# EAGLE design DorkBoard-Programming (EAGLE 5.00)
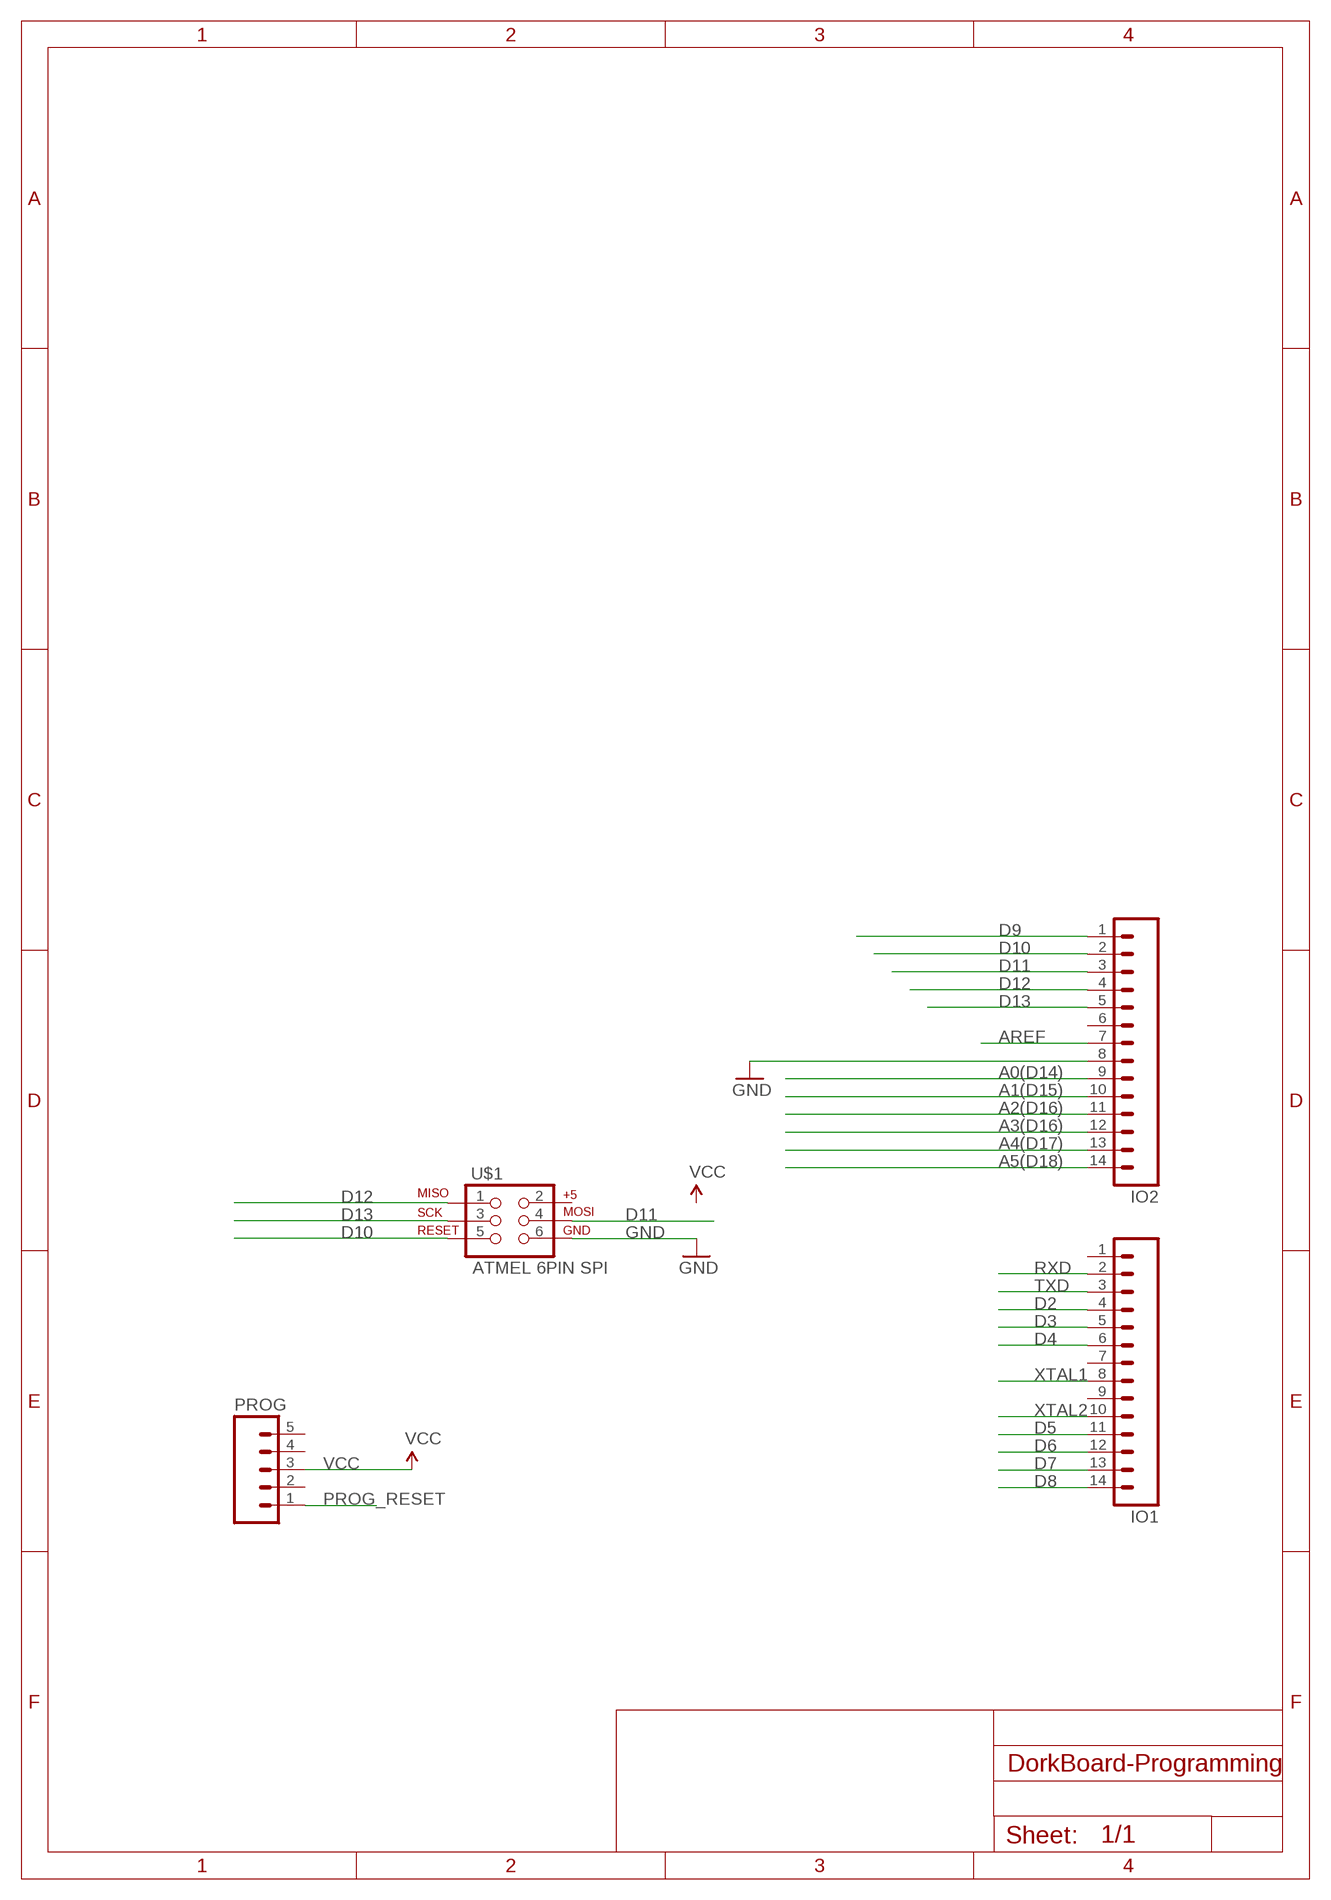
[diagram p0: schematic, sheet 1]

## Parts
IO1  M14  [1X14]
IO2  M14  [1X14]
PROG  M05  [1X05]
U$1  ATMEL 6PIN SPI  AVR_SPI_PRG_6PTH  [2X3]

## Nets
A0(D14): IO2.9
A1(D15): IO2.10
A2(D16): IO2.11
A3(D16): IO2.12
A4(D17): IO2.13
A5(D18): IO2.14
AREF: IO2.7
D2: IO1.4
D3: IO1.5
D4: IO1.6
D5: IO1.11
D6: IO1.12
D7: IO1.13
D8: IO1.14
D9: IO2.1
D10: IO2.2 U$1.5
D11: IO2.3 U$1.4
D12: IO2.4 U$1.1
D13: IO2.5 U$1.3
GND: IO2.8 U$1.6
PROG_RESET: PROG.1
RXD: IO1.2
TXD: IO1.3
VCC: PROG.3
XTAL1: IO1.8
XTAL2: IO1.10
Unconnected: IO1.1 IO1.7 IO1.9 IO2.6 PROG.2 PROG.4 PROG.5 U$1.2

## Library data of the parts
IO1 IO2 = SparkFun:M14: Header 14 Standard 14-pin 0.1" header. Use with straight break away headers (SKU : PRT-00116), right angle break away headers (PRT-00553), swiss pins (PRT-00743), machine pins (PRT-00117), and female headers (PRT-00115).
PROG = SparkFun:M05: Header 5 Standard 5-pin 0.1" header. Use with straight break away headers (SKU : PRT-00116), right angle break away headers (PRT-00553), swiss pins (PRT-00743), machine pins (PRT-00117), and female headers (PRT-00115). Molex polarized connector foot print use with SKU : PRT-08230 with associated crimp pins and housings.
U$1 = 3d:AVR_SPI_PRG_6: AVR ISP 6 Pin This is the reduced ISP connector for AVR programming. Common on Arduino. This footprint will take up less PCB space and can be used with a 10-pin to 6-pin adapter such as SKU: BOB-08508

## Board
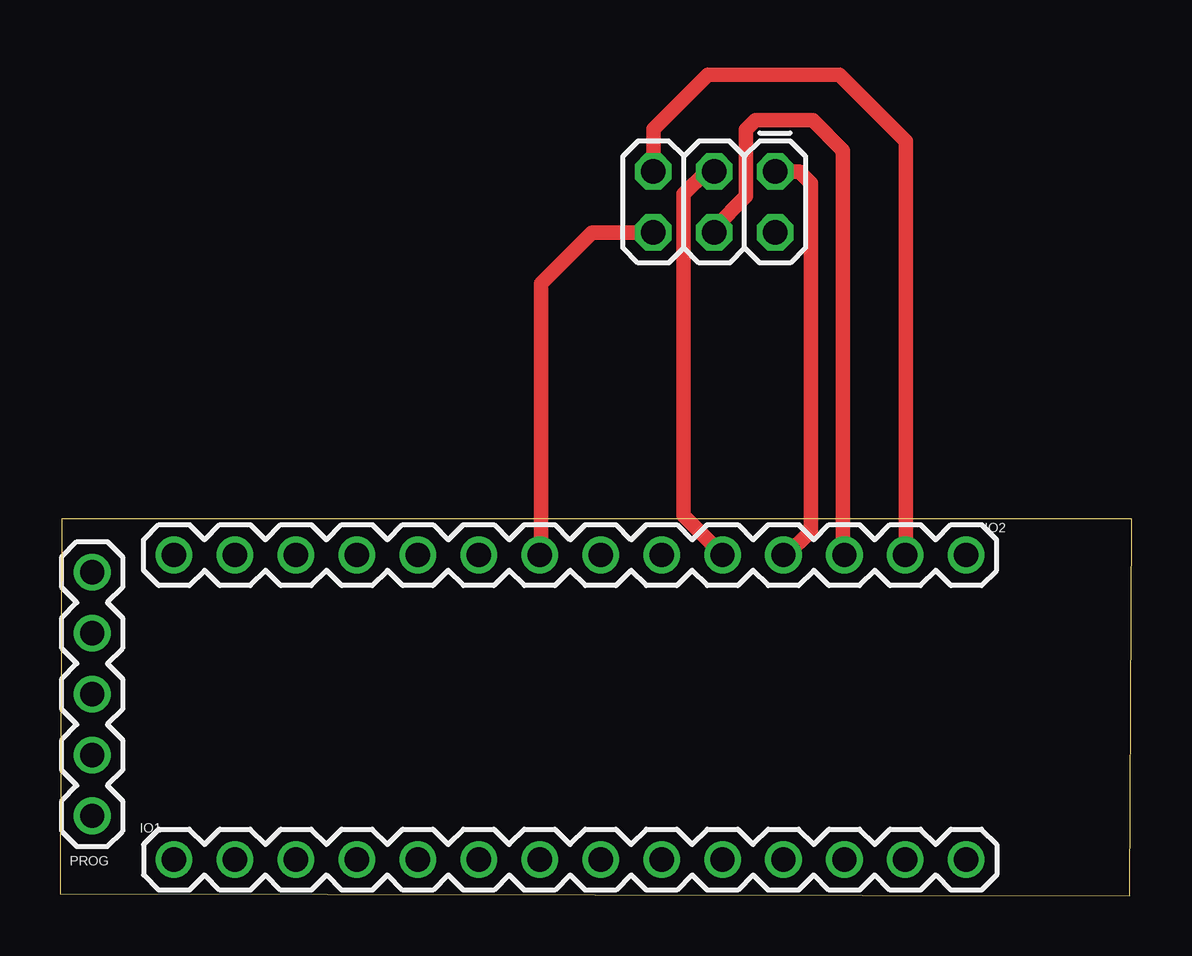
[diagram p1: board, top side]

Size 44.68 x 15.71 mm. Coordinates in mm from the lower left corner, seen from the top.
Outline: 0,0.08 44.6,0 44.68,15.71 0.08,15.71 0,0.08
Copper layers (1*16): Top 0.0178mm / dielectric 1.4986mm / Bottom 0.0178mm
Design rules "SSC-EAGLE-2Lyr_v1.0.0.3": minimum track width 6mil, minimum drill 14mil, track to track 6mil, track to pad 6mil, pad to pad 6mil, via to via 6mil, smd to smd 6mil, copper to edge 20mil, drill to drill 16mil, minimum pad ring 8mil, minimum via ring 8mil, stop-mask expansion 3mil, vias tented up to drill 0mil, thermal gap 10mil

### Footprints (pad centres in the part's own frame; a part is rotated, then mirrored left to right if it is on the bottom)
1X14 = drill 1.016 round: 1 0,0; 2 2.54,0; 3 5.08,0; 4 7.62,0; 5 10.16,0; 6 12.7,0; 7 15.24,0; 8 17.78,0; 9 20.32,0; 10 22.86,0; 11 25.4,0; 12 27.94,0; 13 30.48,0; 14 33.02,0
1X05 = drill 1.016 round: 1 0,0; 2 2.54,0; 3 5.08,0; 4 7.62,0; 5 10.16,0
2X3 = drill 1.016 octagon: 1 0,0; 2 0,2.54; 3 2.54,0; 4 2.54,2.54; 5 5.08,0; 6 5.08,2.54

### Placement (x,y rotation side)
IO1  4.76,1.5 0 top
IO2  37.78,14.2 180 top
PROG  1.34,3.33 90 top
U$1  29.81,30.19 180 top  (outside the outline)

### Tracks (layer width: path | path; a pad name or v marks a point on that pad's centre or on a via)
D10
  Top 0.61: U$1.5 24.73,31.94 27.02,34.23 32.49,34.23 35.26,31.46 35.26,14.02 35.24,14 | 35.18,13.94 35.24,14 | 35.24,14 IO2.2
D11
  Top 0.61: U$1.4 27.27,27.83 28.6,29.16 28.6,31.93 29,32.33 31.38,32.33 32.64,31.06 32.64,14.58 32.88,14.34 32.75,14.2 IO2.3
D12
  Top 0.61: U$1.1 30.82,30.19 31.3,29.71 31.3,15.21 30.27,14.18 30.24,14.2 IO2.4
D13
  Top 0.61: U$1.3 26.94,30.19 25.99,29.24 25.99,15.85 27.63,14.2 | 27.81,14.02 27.63,14.2 | 27.63,14.2 IO2.5
GND
  Top 0.61: U$1.6 22.18,27.65 20.04,25.51 20.04,14.18 20,14.13 | 19.96,14.1 20,14.13 | 20,14.13 IO2.8

### Text on the board
Document: Analog Inputs | Socket | 5 | 4 | 3 | 2 | 1 | 0 | GND | AREF | VCC | 13 | 12 | 11 | 10 | 9 | TXD | RXD | VCC | VCC | GND | GND | C1 | RESET | (4.7-100uf) | C2 | (.1uf) | (RESONATOR) | 8 | 0 | 1 | 2 | 3 | 4 | 5 | 6 | 7 | VCC | RESET